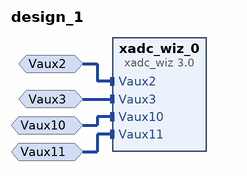
[diagram p0: block diagram of the top level]
# Vivado block design design_1, Vivado 2014.2
create_bd_design design_1

create_bd_intf_port -mode Slave -vlnv xilinx.com:interface:diff_analog_io_rtl:1.0 Vaux2
create_bd_intf_port -mode Slave -vlnv xilinx.com:interface:diff_analog_io_rtl:1.0 Vaux3
create_bd_intf_port -mode Slave -vlnv xilinx.com:interface:diff_analog_io_rtl:1.0 Vaux10
create_bd_intf_port -mode Slave -vlnv xilinx.com:interface:diff_analog_io_rtl:1.0 Vaux11

create_bd_cell -type ip -vlnv xilinx.com:ip:xadc_wiz:3.0 xadc_wiz_0
set_property -dict [list \
  CONFIG.INTERFACE_SELECTION None \
  CONFIG.XADC_STARUP_SELECTION channel_sequencer \
  CONFIG.OT_ALARM false \
  CONFIG.USER_TEMP_ALARM false \
  CONFIG.VCCINT_ALARM false \
  CONFIG.VCCAUX_ALARM false \
  CONFIG.CHANNEL_ENABLE_TEMPERATURE true \
  CONFIG.CHANNEL_ENABLE_VCCINT true \
  CONFIG.CHANNEL_ENABLE_VP_VN false \
  CONFIG.CHANNEL_ENABLE_VAUXP0_VAUXN0 false \
  CONFIG.CHANNEL_ENABLE_VAUXP2_VAUXN2 true \
  CONFIG.CHANNEL_ENABLE_VAUXP3_VAUXN3 true \
  CONFIG.CHANNEL_ENABLE_VAUXP4_VAUXN4 false \
  CONFIG.CHANNEL_ENABLE_VAUXP5_VAUXN5 false \
  CONFIG.CHANNEL_ENABLE_VAUXP6_VAUXN6 false \
  CONFIG.CHANNEL_ENABLE_VAUXP10_VAUXN10 true \
  CONFIG.CHANNEL_ENABLE_VAUXP11_VAUXN11 true \
  CONFIG.CHANNEL_ENABLE_VAUXP15_VAUXN15 false \
  CONFIG.AVERAGE_ENABLE_VP_VN false \
  CONFIG.AVERAGE_ENABLE_VAUXP0_VAUXN0 false \
  CONFIG.AVERAGE_ENABLE_VAUXP4_VAUXN4 false \
  CONFIG.AVERAGE_ENABLE_VAUXP5_VAUXN5 false \
  CONFIG.AVERAGE_ENABLE_VAUXP6_VAUXN6 false \
  CONFIG.AVERAGE_ENABLE_VAUXP15_VAUXN15 false \
  CONFIG.AVERAGE_ENABLE_TEMPERATURE false \
] [get_bd_cells xadc_wiz_0]

# ---- connections ----

connect_bd_intf_net -intf_net Vaux2_1 [get_bd_intf_ports Vaux2] [get_bd_intf_pins xadc_wiz_0/Vaux2]
connect_bd_intf_net -intf_net Vaux3_1 [get_bd_intf_ports Vaux3] [get_bd_intf_pins xadc_wiz_0/Vaux3]
connect_bd_intf_net -intf_net Vaux10_1 [get_bd_intf_ports Vaux10] [get_bd_intf_pins xadc_wiz_0/Vaux10]
connect_bd_intf_net -intf_net Vaux11_1 [get_bd_intf_ports Vaux11] [get_bd_intf_pins xadc_wiz_0/Vaux11]

validate_bd_design
save_bd_design
